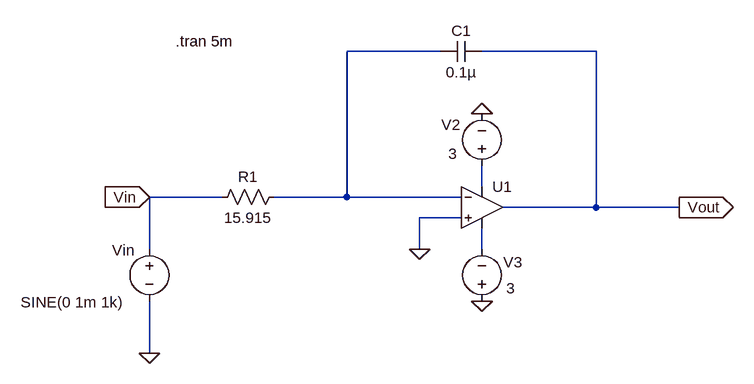
[diagram p0: schematic OpAmp_Integrator.asc]
OpAmp_Integrator.asc, the LTspice schematic file:
Version 4
SHEET 1 880 680
WIRE 272 -64 128 -64
WIRE 512 -64 336 -64
WIRE 336 144 336 112
WIRE -64 160 -176 160
WIRE 128 160 128 -64
WIRE 128 160 16 160
WIRE 304 160 128 160
WIRE 512 176 512 -64
WIRE 512 176 368 176
WIRE 640 176 512 176
WIRE 304 192 240 192
WIRE -176 240 -176 160
WIRE 240 240 240 192
WIRE 336 240 336 208
WIRE -176 400 -176 320
FLAG 336 32 0
FLAG 336 320 0
FLAG 240 240 0
FLAG -176 400 0
FLAG 640 176 Vout
IOPIN 640 176 Out
FLAG -176 160 Vin
IOPIN -176 160 In
SYMBOL voltage -176 224 R0
WINDOW 0 -57 18 Left 2
WINDOW 3 -198 98 Left 2
WINDOW 123 0 0 Left 0
WINDOW 39 0 0 Left 0
SYMATTR InstName Vin
SYMATTR Value SINE(0 1m 1k)
SYMBOL voltage 336 128 R180
WINDOW 0 33 79 Left 2
WINDOW 3 38 35 Left 2
WINDOW 123 0 0 Left 0
WINDOW 39 0 0 Left 0
SYMATTR InstName V2
SYMATTR Value 3
SYMBOL voltage 336 336 R180
WINDOW 0 -62 76 Left 2
WINDOW 3 -51 36 Left 2
WINDOW 123 0 0 Left 0
WINDOW 39 0 0 Left 0
SYMATTR InstName V3
SYMATTR Value 3
SYMBOL cap 336 -80 R90
WINDOW 0 0 32 VBottom 2
WINDOW 3 32 32 VTop 2
SYMATTR InstName C1
SYMATTR Value 0.1µ
SYMBOL res 32 144 R90
WINDOW 0 0 56 VBottom 2
WINDOW 3 32 56 VTop 2
SYMATTR InstName R1
SYMATTR Value 15.915
SYMBOL Opamps\\UniversalOpamp2 336 176 R0
SYMATTR InstName U1
SYMATTR Value2 Avol=1Meg GBW=100000Meg Slew=10Meg
TEXT -136 -80 Left 2 !.tran 5m

The netlist it stands for:
* OpAmp_Integrator.asc
Vin Vin 0 SINE(0 1m 1k)
V2 N002 0 3
V3 0 N003 3
C1 Vout N001 0.1µ
R1 N001 Vin 15.915
XU1 0 N001 N002 N003 Vout level.2 Avol=1Meg GBW=100000Meg Slew=10Meg ilimit=25m rail=0 Vos=0 phimargin=45 en=0 enk=0 in=0 ink=0 Rin=500Meg  ; pins IN+ IN- V+ V- OUT
.tran 5m
.lib UniversalOpamps2.sub
.backanno
.end